# Altium schematic sheet Schematic.SchDoc
size A; Author: DBARMPAKOS; CompanyName: AUA - KEKYTE; DrawnBy: DBARMPAKOS; Engineer: DBARMPAKOS
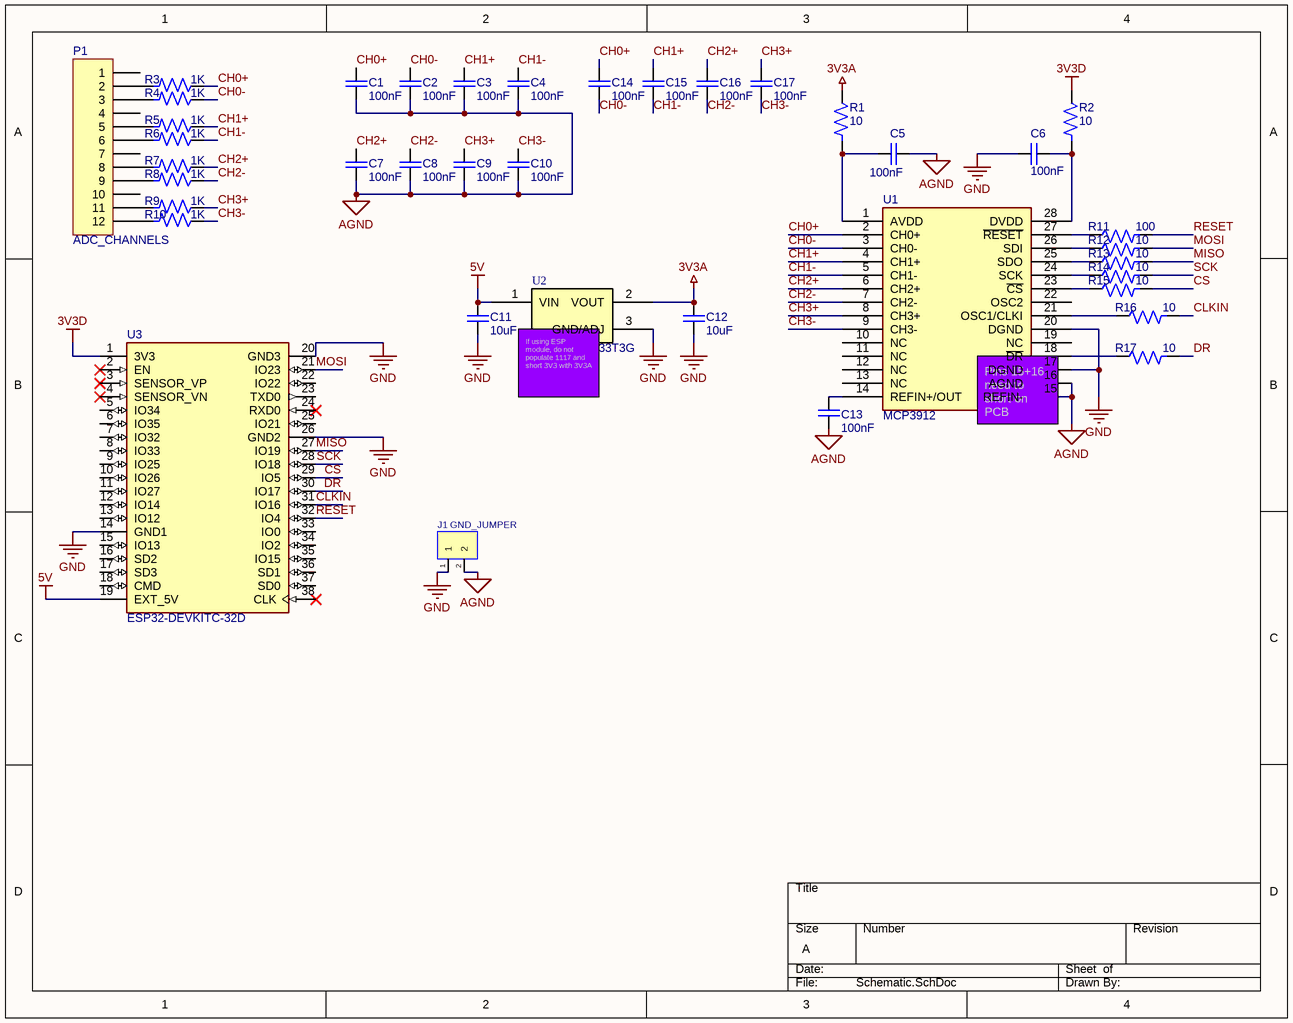
[diagram p0: Schematic.SchDoc]

## Parts
C1  100nF  [CAP_0603]
C2  100nF  [CAP_0603]
C3  100nF  [CAP_0603]
C4  100nF  [CAP_0603]
C5  100nF  [CAP_0603]
C6  100nF  [CAP_0603]
C7  100nF  [CAP_0603]
C8  100nF  [CAP_0603]
C9  100nF  [CAP_0603]
C10  100nF  [CAP_0603]
C11  10uF  [CAP_0603]
C12  10uF  [CAP_0603]
C13  100nF  [CAP_0603]
C14  100nF  [CAP_0603]
C15  100nF  [CAP_0603]
C16  100nF  [CAP_0603]
C17  100nF  [CAP_0603]
J1  GND_JUMPER  [CONN 2POS 2.54PITCH]
P1  ADC_CHANNELS  [HDR1X12]
R1  10  [RES_0805]
R2  10  [RES_0805]
R3  1K  [RES_0805]
R4  1K  [RES_0805]
R5  1K  [RES_0805]
R6  1K  [RES_0805]
R7  1K  [RES_0805]
R8  1K  [RES_0805]
R9  1K  [RES_0805]
R10  1K  [RES_0805]
R11  100  [RES_0805]
R12  10  [RES_0805]
R13  10  [RES_0805]
R14  10  [RES_0805]
R15  10  [RES_0805]
R16  10  [RES_0805]
R17  10  [RES_0805]
U1  MCP3912  [TI SSOP-24 DB]
U2  NCP1117ST33T3G  [SOT223]
U3  ESP32-DEVKITC-32D  [MODULE_ESP32-DEVKITC-32D]

## Nets
3V3A: C12.1 R1.2 U2.2(VOUT)
3V3D: R2.2 U3.1(3V3)
5V: C11.1 U2.1(VIN) U3.19(EXT_5V)
AGND: C1.2 C2.2 C3.2 C4.2 C5.2 C7.2 C8.2 C9.2 C10.2 C13.1 J1.2 U1.15(REFIN-) U1.16(AGND)
GND: C6.1 C11.2 C12.2 J1.1 U1.17(DGND) U1.20(DGND) U2.3(GND/ADJ) U3.14(GND1) U3.20(GND3) U3.26(GND2)
CH0+: C1.1 C14.1 R3.2 U1.2(CH0+)
CH0-: C2.1 C14.2 R4.2 U1.3(CH0-)
CH1+: C3.1 C15.1 R5.2 U1.4(CH1+)
CH1-: C4.1 C15.2 R6.2 U1.5(CH1-)
CH2+: C7.1 C16.1 R7.2 U1.6(CH2+)
CH2-: C8.1 C16.2 R8.2 U1.7(CH2-)
CH3+: C9.1 C17.1 R9.2 U1.8(CH3+)
CH3-: C10.1 C17.2 R10.2 U1.9(CH3-)
CLKIN: R16.1 U3.31(IO16)
CS: R15.1 U3.29(IO5)
DR: R17.1 U3.30(IO17)
MISO: R13.1 U3.27(IO19)
MOSI: R12.1 U3.21(IO23)
RESET: R11.1 U3.32(IO4)
SCK: R14.1 U3.28(IO18)
NetC5_1: C5.1 R1.1 U1.1(AVDD)
NetC6_2: C6.2 R2.1 U1.28(DVDD)
NetC13_2: C13.2 U1.14(REFIN+/OUT)
NetP1_2: P1.2 R3.1
NetP1_3: P1.3 R4.1
NetP1_5: P1.5 R5.1
NetP1_6: P1.6 R6.1
NetP1_8: P1.8 R7.1
NetP1_9: P1.9 R8.1
NetP1_11: P1.11 R9.1
NetP1_12: P1.12 R10.1
NetR11_2: R11.2 U1.27(~{RESET})
NetR12_2: R12.2 U1.26(SDI)
NetR13_2: R13.2 U1.25(SDO)
NetR14_2: R14.2 U1.24(SCK)
NetR15_2: R15.2 U1.23(~{CS})
NetR16_2: R16.2 U1.21(OSC1/CLKI)
NetR17_2: R17.2 U1.18(~{DR})

Not connected (* = marked no-connect by the designer): P1 1 4 7 10; U1 10(NC) 11(NC) 12(NC) 13(NC) 19(NC) 22(OSC2); U3 2(EN)* 3(SENSOR_VP)* 4(SENSOR_VN)* 5(IO34) 6(IO35) 7(IO32) 8(IO33) 9(IO25) 10(IO26) 11(IO27) 12(IO14) 13(IO12) 15(IO13) 16(SD2) 17(SD3) 18(CMD) 22(IO22) 23(TXD0) 24(RXD0)* 25(IO21) 33(IO0) 34(IO2) 35(IO15) 36(SD1) 37(SD0) 38(CLK)*

## Notes on the sheet
- (near U2) If using ESP module, do not populate 1117 and short 3V3 with 3V3A
- (near U1) Pins 15+16 need to short on PCB

## Library data of the parts
C1-C17 = Cap 100nF 6V 603 Ceramic: Manufacturer: KEMET; Manufacturer Part Number: C0603C104K9RACTU; Part # Aliases: C0603C104K9RAC7867; Capacitance: 0.1 uF; Capacitance - pF: 100000 pF; Case Height: 0.8 mm; Dielectric: X7R; Case Length: 1.6 mm; Class: Class 1; Dissipation Factor DF: 5; Voltage Rating: 6.3 V; Tolerance: 10 %; Temperature Coefficient / Code: +/- 15 %; Type: SMD MLCC X7R 6.3 - 250 VDC Commerical Grade; Supplier 1: Digi-Key; Stock 1: 25357; Pricing 1: 1=0.18, 10=0.126, 100=0.0594, 500=0.0417, 1000=0.0345 (USD); Brand: Kemet; Capacitance - nF: 100 nF; Case Code - in: 0603; Case Code - mm: 1608; Dimensions: 0.8 mm W x 1.6 mm L x 0.8 mm H; Case Width: 0.8 mm; Factory Pack Quantity: 4000; Product Category: Multilayer Ceramic Capacitors MLCC - SMD/SMT; RoHS: Details; Minimum Operating Temperature: - 55 C; Maximum Operating Temperature: + 125 C; Product: General Type MLCCs; Operating Temperature Range: - 55 C to + 125 C; Package / Case: 0603 (1608 metric); Packaging: Reel; Series: C0603C; Termination Style: SMD/SMT; Voltage Rating DC: 6.3 V; ComponentLink1URL: http://www.mouser.com/ds/2/212/KEM_C1002_X7R_SMD-1102033.pdf?src-supplier=Mouser; ComponentLink1Description: http://www.mouser.com/ds/2/212/KEM_C1002_X7R_SMD-1102033.pdf?src-supplier=Mouser; Supplier Part Number 1: 399-15351-1-ND
J1 = CONN HEADER VERT 2POS 2.54MM: Connector Header Through Hole 2 position 0.100" (2.54mm); Manufacturer: Molex; Current rating: 4A; Voltage rating: 250V; Supplier 1: Digi-Key; Manufacturer Part Number: 22-27-2021; Stock 1: 0; Pricing 1: 1=0.27, 10=0.251, 100=0.1737, 500=0.147, 1000=0.1202, 5000=0.1069, 10000=0.0969 (USD); Contact material: Tin plated brass; Housing material: Nylon (UL94V-0); Operating temperature: 0°C to +75°C; ComponentLink1URL: http://www.molex.com/webdocs/datasheets/pdf/en-us/0022272021_PCB_HEADERS.pdf?src-supplier=Avnet; ComponentLink1Description: http://www.molex.com/webdocs/datasheets/pdf/en-us/0022272021_PCB_HEADERS.pdf?src-supplier=Avnet; ComponentLink2URL: https://www.verical.com/server-webapp/html/getDatasheet?partID=163454&src-supplier=Verical; ComponentLink2Description: https://www.verical.com/server-webapp/html/getDatasheet?partID=163454&src-supplier=Verical; ComponentLink3URL: http://www.farnell.com/datasheets/2305438.pdf?src-supplier=Mouser; ComponentLink3Description: http://www.farnell.com/datasheets/2305438.pdf?src-supplier=Mouser; ComponentLink4URL: http://www.farnell.com/datasheets/2305438.pdf?src-supplier=Avnet+Europe; ComponentLink4Description: http://www.farnell.com/datasheets/2305438.pdf?src-supplier=Avnet+Europe; ComponentLink5URL: http://uk.rs-online.com/webdocs/13c2/0900766b813c2e6e.pdf?src-supplier=RSComponents; ComponentLink5Description: http://uk.rs-online.com/webdocs/13c2/0900766b813c2e6e.pdf?src-supplier=RSComponents; ComponentLink6URL: http://www.rapidonline.com/pdf/22-0838e.pdf?src-supplier=Rapid+Electronics; ComponentLink6Description: http://www.rapidonline.com/pdf/22-0838e.pdf?src-supplier=Rapid+Electronics; ComponentLink7URL: http://www.farnell.com/datasheets/2305438.pdf?src-supplier=Jameco; ComponentLink7Description: http://www.farnell.com/datasheets/2305438.pdf?src-supplier=Jameco; Supplier Part Number 1: WM4111-ND
P1 = Header 12: Header, 12-Pin; LatestRevisionDate: 17-Jul-2002; LatestRevisionNote: Re-released for DXP Platform.; Publisher: Altium Limited
R1-R17 = Res 1K 0805 5% 1/8W: Manufacturer: Yageo; Manufacturer Part Number: RC0805JR-071KL; Resistance: 1 kOhms; Power Rating: 125 mW (1/8 W); Voltage Rating: 150 V; Temperature Coefficient: 100 PPM / C; Supplier 1: Digi-Key; Stock 1: 5115220; Pricing 1: 1=0.1, 10=0.035, 100=0.014, 1000=0.0063, 2500=0.0055 (USD); Termination Style: SMD/SMT; Product: Thick Film Resistors General Purpose; Tolerance: 5 %; Case Code - in: 0805; Case Code - mm: 2012; Series: RC; Operating Temperature Range: - 55 C to + 155 C; Packaging: Reel; ComponentLink1URL: http://www.farnell.com/datasheets/2167052.pdf?src-supplier=Verical; ComponentLink1Description: http://www.farnell.com/datasheets/2167052.pdf?src-supplier=Verical; ComponentLink2URL: http://www.farnell.com/datasheets/2167052.pdf?src-supplier=Mouser; ComponentLink2Description: http://www.farnell.com/datasheets/2167052.pdf?src-supplier=Mouser; ComponentLink3URL: http://www.farnell.com/datasheets/2167052.pdf?src-supplier=Element14; ComponentLink3Description: http://www.farnell.com/datasheets/2167052.pdf?src-supplier=Element14; ComponentLink4URL: http://www.farnell.com/datasheets/444164.pdf?src-supplier=Element14; ComponentLink4Description: http://www.farnell.com/datasheets/444164.pdf?src-supplier=Element14; Supplier Part Number 1: 311-1.0KARCT-ND
U3 = ESP32-DEVKITC-32D: EVAL BOARD FOR ESP-WROOM-32; MF: Espressif Systems; Value: *; MP: ESP32-DEVKITC-32D; Price: None; Check_prices: https://www.snapeda.com/parts/ESP32-DEVKITC-32D/Espressif%20Systems/view-part/2777395/?ref=eda; SnapEDA_Link: https://www.snapeda.com/parts/ESP32-DEVKITC-32D/Espressif%20Systems/view-part/2777395/?ref=snap; Availability: Warning; Purchase-URL: https://pricing.snapeda.com/search/part/ESP32-DEVKITC-32D/?ref=eda; Package: None